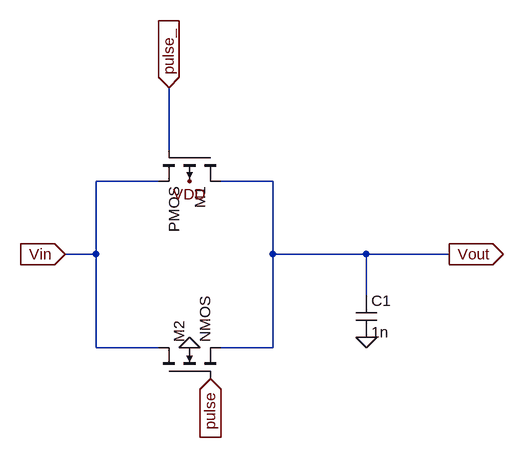
[diagram p0: schematic TG_NEW.asc]
TG_NEW.asc, the LTspice schematic file:
Version 4
SHEET 1 880 680
WIRE 112 16 112 -80
WIRE 96 64 0 64
WIRE 272 64 192 64
WIRE 0 176 0 64
WIRE 0 176 -48 176
WIRE 272 176 272 64
WIRE 416 176 272 176
WIRE 544 176 416 176
WIRE 416 240 416 176
WIRE 0 320 0 176
WIRE 96 320 0 320
WIRE 272 320 272 176
WIRE 272 320 192 320
FLAG 176 368 pulse
IOPIN 176 368 In
FLAG -48 176 Vin
IOPIN -48 176 In
FLAG 544 176 Vout
IOPIN 544 176 Out
FLAG 416 304 0
FLAG 144 320 0
FLAG 144 64 VDD
FLAG 112 -80 pulse_
IOPIN 112 -80 In
SYMBOL pmos4 192 16 R90
SYMATTR InstName M1
SYMBOL nmos4 96 368 R270
SYMATTR InstName M2
SYMBOL cap 400 240 R0
SYMATTR InstName C1
SYMATTR Value 1n

The netlist it stands for:
* TG_NEW.asc
M1 Vout pulse_ Vin VDD PMOS
M2 Vin pulse Vout 0 NMOS
C1 Vout 0 1n
.model NMOS NMOS
.model PMOS PMOS
.lib standard.mos
.backanno
.end